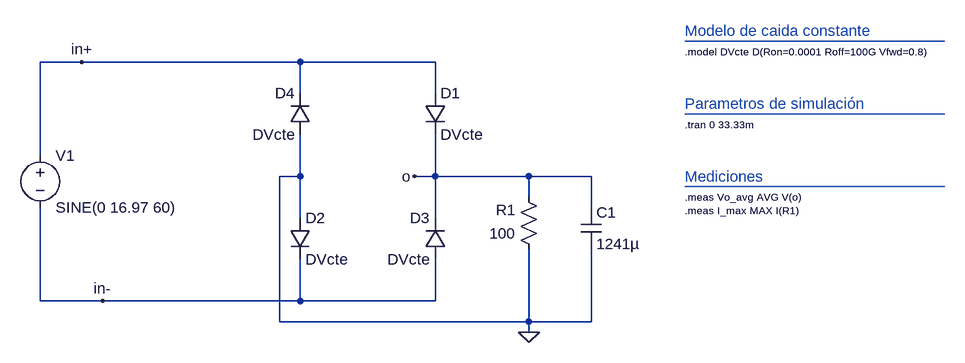
[diagram p0: schematic rectificador-onda-completa-puente_filtro.asc]
rectificador-onda-completa-puente_filtro.asc, the LTspice schematic file:
Version 4
SHEET 1 1444 680
WIRE 112 -32 48 -32
WIRE 448 -32 112 -32
WIRE 656 -32 448 -32
WIRE 448 16 448 -32
WIRE 656 16 656 -32
WIRE 48 112 48 -32
WIRE 448 144 448 80
WIRE 448 144 416 144
WIRE 656 144 656 80
WIRE 656 144 624 144
WIRE 800 144 656 144
WIRE 896 144 800 144
WIRE 800 176 800 144
WIRE 896 192 896 144
WIRE 448 208 448 144
WIRE 656 208 656 144
WIRE 48 336 48 192
WIRE 144 336 48 336
WIRE 448 336 448 272
WIRE 448 336 144 336
WIRE 656 336 656 272
WIRE 656 336 448 336
WIRE 416 368 416 144
WIRE 800 368 800 256
WIRE 800 368 416 368
WIRE 896 368 896 256
WIRE 896 368 800 368
WIRE 800 384 800 368
FLAG 800 384 0
FLAG 624 144 o
FLAG 112 -32 in+
FLAG 144 336 in-
SYMBOL diode 640 16 R0
SYMATTR InstName D1
SYMATTR Value DVcte
SYMBOL voltage 48 96 R0
WINDOW 123 0 0 Left 0
WINDOW 39 0 0 Left 0
SYMATTR InstName V1
SYMATTR Value SINE(0 16.97 60)
SYMBOL res 816 272 R180
WINDOW 0 36 76 Left 2
WINDOW 3 36 40 Left 2
SYMATTR InstName R1
SYMATTR Value 100
SYMBOL diode 432 208 R0
SYMATTR InstName D2
SYMATTR Value DVcte
SYMBOL diode 672 272 R180
WINDOW 0 24 64 Left 2
WINDOW 3 24 0 Left 2
SYMATTR InstName D3
SYMATTR Value DVcte
SYMBOL diode 464 80 R180
WINDOW 0 24 64 Left 2
WINDOW 3 24 0 Left 2
SYMATTR InstName D4
SYMATTR Value DVcte
SYMBOL cap 880 192 R0
SYMATTR InstName C1
SYMATTR Value 1241µ
TEXT 1040 64 Left 1 !.tran 0 33.33m
TEXT 1040 -48 Left 1 !.model DVcte D(Ron=0.0001 Roff=100G Vfwd=0.8)
TEXT 1040 -80 Left 2 ;Modelo de caida constante
TEXT 1040 32 Left 2 ;Parametros de simulación
TEXT 1040 144 Left 2 ;Mediciones
TEXT 1040 176 Left 1 !.meas Vo_avg AVG V(o)\n.meas I_max MAX I(R1)
LINE Normal 1440 48 1040 48
LINE Normal 1440 48 1440 48 2
LINE Normal 1440 48 1440 48 2
LINE Normal 1440 160 1040 160
LINE Normal 1440 -64 1040 -64

The netlist it stands for:
* rectificador-onda-completa-puente_filtro.asc
D1 in+ o DVcte
V1 in+ in- SINE(0 16.97 60)
R1 0 o 100
D2 0 in- DVcte
D3 in- o DVcte
D4 0 in+ DVcte
C1 o 0 1241µ
.model D D
.lib standard.dio
.tran 0 33.33m
.model DVcte D(Ron=0.0001 Roff=100G Vfwd=0.8)
* Modelo de caida constante
* Parametros de simulación
* Mediciones
.meas Vo_avg AVG V(o)
.meas I_max MAX I(R1)
.backanno
.end